# Altium schematic sheet Driver.SchDoc
size A4
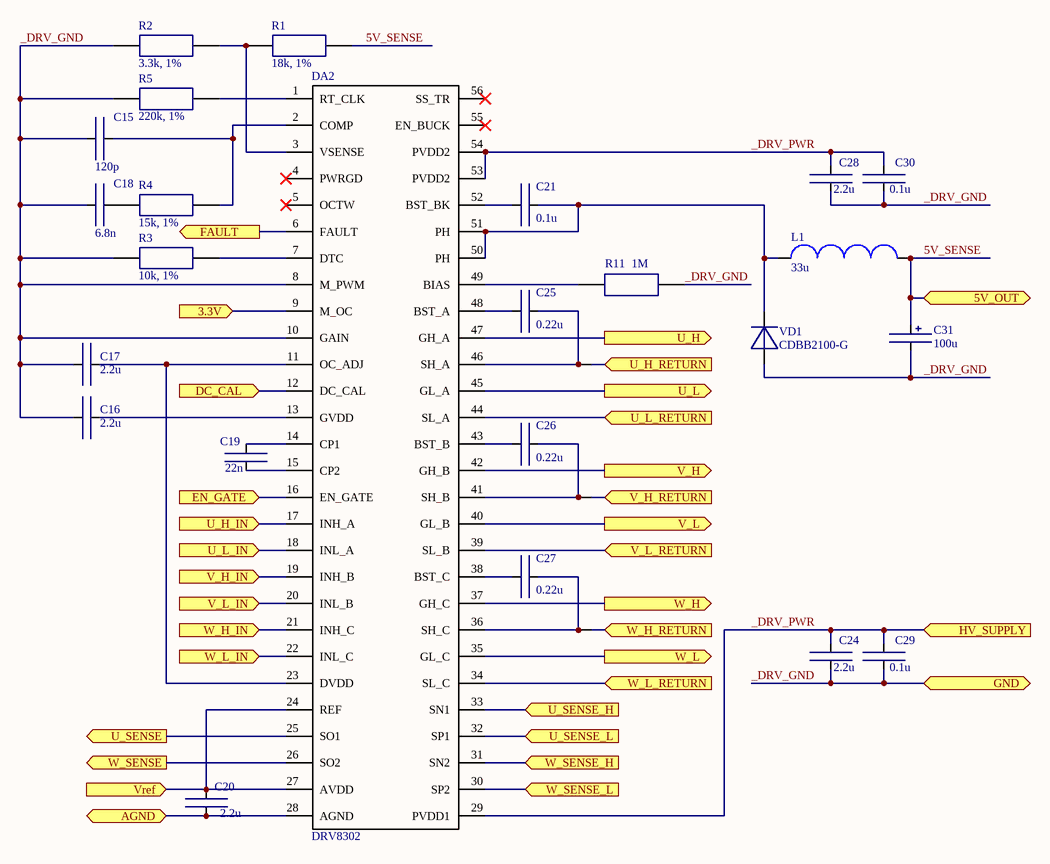
[diagram p0: Driver.SchDoc]

## Parts
C15  120p  [CAPC1608X08N(0603)]
C16  2.2u  [CAPC1608X08N(0603)]
C17  2.2u  [CAPC1608X08N(0603)]
C18  6.8n  [CAPC1608X08N(0603)]
C19  22n  [CAPC1608X08N(0603)]
C20  2.2u  [CAPC1608X08N(0603)]
C21  0.1u  [CAPC1608X08N(0603)]
C24  2.2u  [EIA CC1210]
C25  0.22u  [CAPC1608X08N(0603)]
C26  0.22u  [CAPC1608X08N(0603)]
C27  0.22u  [CAPC1608X08N(0603)]
C28  2.2u  [EIA CC1210]
C29  0.1u  [C0805]
C30  0.1u  [C0805]
C31  100u  [CAP type B]
DA2  DRV8302  [HTSSOP56(L)]
L1  33u  [DR74]
NT1  NET_TIE  [NET_TIE]  (value not drawn)  (net tie, no BOM)
NT2  NET_TIE  [NET_TIE]  (value not drawn)  (net tie, no BOM)
NT3  NET_TIE  [NET_TIE]  (value not drawn)  (net tie, no BOM)
R1  18k, 1%  [RESC1608X05N(0603)]
R2  3.3k, 1%  [RESC1608X05N(0603)]
R3  10k, 1%  [RESC1608X05N(0603)]
R4  15k, 1%  [RESC1608X05N(0603)]
R5  220k, 1%  [RESC1608X05N(0603)]
R11  1M  [RESC1608X05N(0603)]
VD1  CDBB2100-G  [SMA(DO-214AC)]

## Ports
3.3V (in), 5V_OUT, AGND (bidir), DC_CAL (in), EN_GATE (in), FAULT (out), GND (bidir), HV_SUPPLY (in), U_H (out), U_H_IN (in), U_H_RETURN (in), U_L (out), U_L_IN (in), U_L_RETURN (in), U_SENSE (out), U_SENSE_H (in), U_SENSE_L (in), V_H (out), V_H_IN (in), V_H_RETURN (in), V_L (out), V_L_IN (in), V_L_RETURN (in), Vref (in), W_H (out), W_H_IN (in), W_H_RETURN (in), W_L (out), W_L_IN (in), W_L_RETURN (in), W_SENSE (out), W_SENSE_H (in), W_SENSE_L (in)

## Nets
GND: DA2.57
3.3V: DA2.9(M_OC) ; port 3.3V
5V_SENSE: C31.1 L1.2 R1.1 ; port 5V_OUT
_DRV_GND: C15.1 C16.1 C17.2 C18.1 C24.2 C28.2 C29.2 C30.2 C31.2 DA2.8(M_PWM) DA2.10(GAIN) R2.2 R3.1 R5.2 R11.2 VD1.1 ; port GND
_DRV_PWR: C24.1 C28.1 C29.1 C30.1 DA2.29(PVDD1) DA2.53(PVDD2) DA2.54(PVDD2) ; port HV_SUPPLY
AGND: C20.2 DA2.28(AGND) ; port AGND
DC_CAL: DA2.12(DC_CAL) ; port DC_CAL
EN_GATE: DA2.16(EN_GATE) ; port EN_GATE
FAULT: DA2.6(FAULT) ; port FAULT
U_H: DA2.47(GH_A) ; port U_H
U_H_IN: DA2.17(INH_A) ; port U_H_IN
U_H_RETURN: NT1.1 ; port U_H_RETURN
U_L: DA2.45(GL_A) ; port U_L
U_L_IN: DA2.18(INL_A) ; port U_L_IN
U_L_RETURN: DA2.44(SL_A) ; port U_L_RETURN
U_SENSE: DA2.25(SO1) ; port U_SENSE
U_SENSE_H: DA2.33(SN1) ; port U_SENSE_H
U_SENSE_L: DA2.32(SP1) ; port U_SENSE_L
V_H: DA2.42(GH_B) ; port V_H
V_H_IN: DA2.19(INH_B) ; port V_H_IN
V_H_RETURN: NT2.1 ; port V_H_RETURN
V_L: DA2.40(GL_B) ; port V_L
V_L_IN: DA2.20(INL_B) ; port V_L_IN
V_L_RETURN: DA2.39(SL_B) ; port V_L_RETURN
Vref: C20.1 DA2.24(REF) DA2.27(AVDD) ; port Vref
W_H: DA2.37(GH_C) ; port W_H
W_H_IN: DA2.21(INH_C) ; port W_H_IN
W_H_RETURN: NT3.1 ; port W_H_RETURN
W_L: DA2.35(GL_C) ; port W_L
W_L_IN: DA2.22(INL_C) ; port W_L_IN
W_L_RETURN: DA2.34(SL_C) ; port W_L_RETURN
W_SENSE: DA2.26(SO2) ; port W_SENSE
W_SENSE_H: DA2.31(SN2) ; port W_SENSE_H
W_SENSE_L: DA2.30(SP2) ; port W_SENSE_L
NetC15_2: C15.2 DA2.2(COMP) R4.2
NetC16_2: C16.2 DA2.13(GVDD)
NetC17_1: C17.1 DA2.11(OC_ADJ) DA2.23(DVDD)
NetC18_2: C18.2 R4.1
NetC19_1: C19.1 DA2.14(CP1)
NetC19_2: C19.2 DA2.15(CP2)
NetC21_1: C21.1 DA2.52(BST_BK)
NetC21_2: C21.2 DA2.50(PH) DA2.51(PH) L1.1 VD1.2
NetC25_1: C25.1 DA2.48(BST_A)
NetC25_2: C25.2 DA2.46(SH_A) NT1.2
NetC26_1: C26.1 DA2.43(BST_B)
NetC26_2: C26.2 DA2.41(SH_B) NT2.2
NetC27_1: C27.1 DA2.38(BST_C)
NetC27_2: C27.2 DA2.36(SH_C) NT3.2
NetDA2_1: DA2.1(RT_CLK) R5.1
NetDA2_3: DA2.3(VSENSE) R1.2 R2.1
NetDA2_7: DA2.7(DTC) R3.2
NetDA2_49: DA2.49(BIAS) R11.1

Not connected (* = marked no-connect by the designer): DA2 4(PWRGD)* 5(OCTW)* 55(EN_BUCK)* 56(SS_TR)*

## Library data of the parts
C15 = Ceramic Chip Capacitor: Value: 120pF, 50V; Order Number: ECJ-1VC1H121J; Distributor: Panasonic; Package: CAPC1608X08N(0603)
C16 C17 C20 = Ceramic Chip Capacitor: Value: 2.2u, 25V, 10%; Order Number: GRM188R61E225KA12D; Distributor: Murata Electronics; Package: CAPC1608X08N(0603)
C18 = Ceramic Chip Capacitor: Value: 6.8n, 50V; Order Number: ECJ-1VB1H682K; Distributor: Panasonic; Package: CAPC1608X08N(0603)
C19 = Ceramic Chip Capacitor: Value: 22n, 50V; Order Number: GRM188R71H223KA01D; Distributor: Murata Electronics; Package: CAPC1608X08N(0603)
C21 = Ceramic Chip Capacitor: Value: 0.1u, 50V; Order Number: 06035C104KAT2A; Distributor: AVX Corporation; Package: CAPC1608X08N(0603)
C24 C28 = Ceramic Chip Capacitor: Value: 2.2u, 100V; Order Number: C3225X7R2A225K; Distributor: TDK Corporation; Package: CC1210
C25-C27 = Ceramic Chip Capacitor: Value: 0.22u, 50V; Order Number: C1608X7R1H224K080AB; Distributor: TDK; Package: 0603
C29 C30 = Ceramic Chip Capacitor: Value: 0.1u, 100V; Order Number: C0805C104K1RACTU; Distributor: Kemet Electronics Corporation; Package: 0805
C31 = Tantalum Chip Capacitor: Value: 100u, 6.3v; Order Number: 581-TPSB107K006R0400; Package: B; Distributor: *
DA2 = DRV8302: Order Number: DRV8302DCA; Package: HTSSOP-56-PP
L1 = DR74: Order Number: DR74-330-R; Value: 33u
NT1-NT3 = Net tie
R1 = SMD: Order Number: ERJ-3EKF1802V; Value: 18k, 1%; Package: RESC1608X05N(0603); Distributor: Panasonic
R2 = SMD: Order Number: ERJ-3EKF3301V; Value: 3.3k, 1%; Package: RESC1608X05N(0603); Distributor: Panasonic
R3 = SMD: Order Number: ERJ-3EKF1002V; Value: 10k, 1%; Package: RESC1608X05N(0603); Distributor: Panasonic
R4 = SMD: Order Number: ERJ-3EKF1502V; Value: 15k, 1%; Package: RESC1608X05N(0603); Distributor: Panasonic
R5 = SMD: Order Number: ERJ-3EKF2203V; Value: 220k, 1%; Package: RESC1608X05N(0603); Distributor: Panasonic
R11 = SMD: Order Number: ERJ-3GEYJ105V; Value: 1M; Package: RESC1608X05N(0603); Distributor: Panasonic
VD1 = ES1A...D: Order Number: CDBB2100-G; Distributor: Comchip Technology